# EAGLE design BGC main (EAGLE 7.0.0)
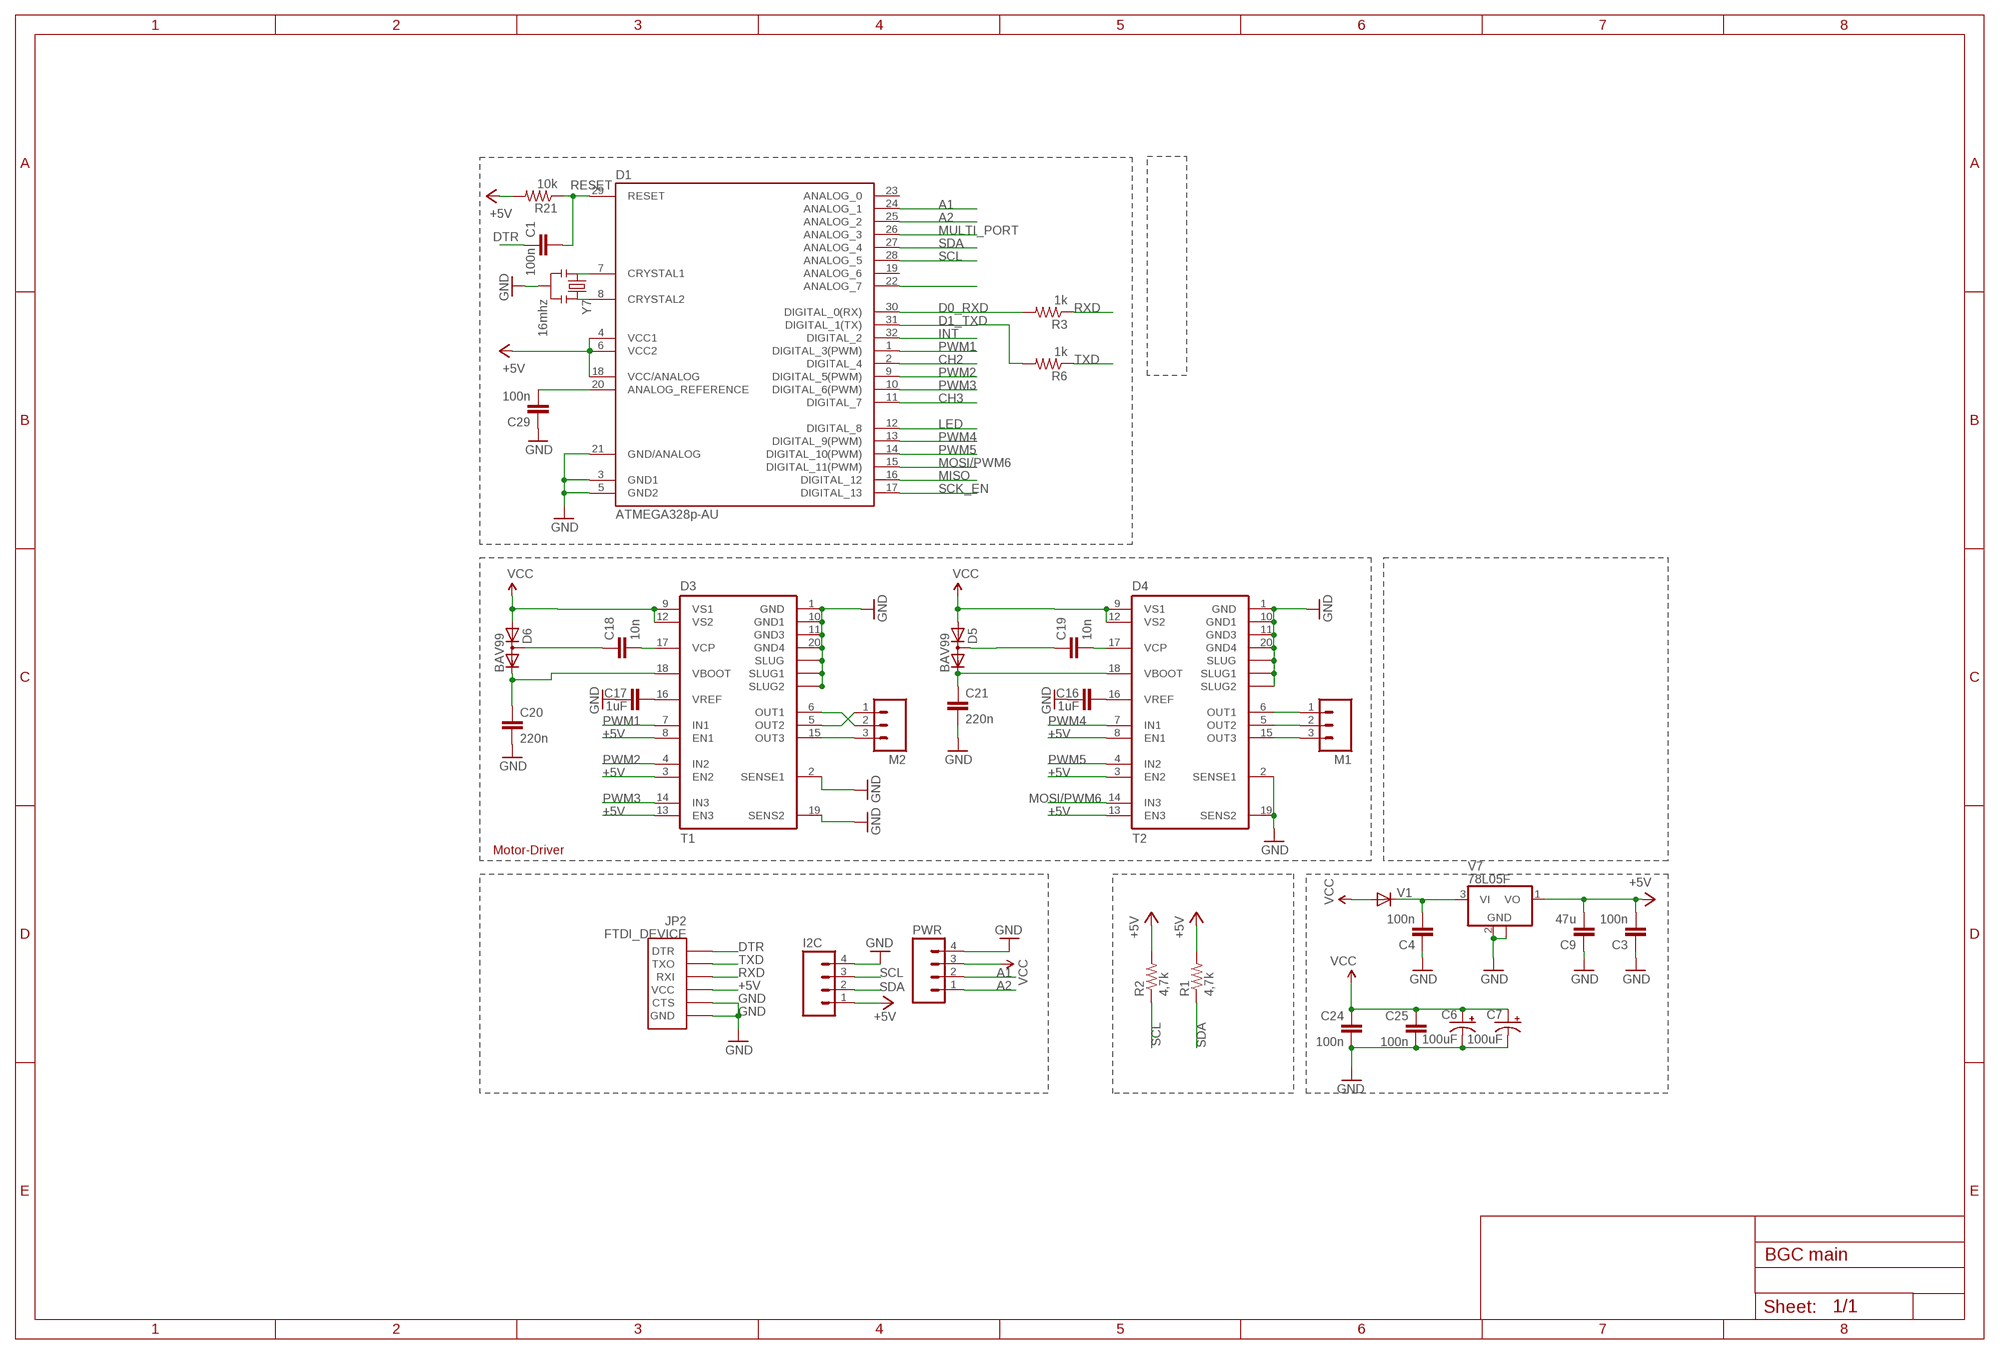
[diagram p0: schematic, sheet 1]

## Parts
C1  100n  CAP0402-CAP  [0402-CAP]
C3  100n  CAP0402-CAP  [0402-CAP]
C4  100n  CAP0402-CAP  [0402-CAP]
C6  100uF  100UF-10V-10%(TANT)  [EIA7343]
C7  100uF  100UF-10V-10%(TANT)  [EIA7343]
C9  47u  C-EUC1210  [C1210]
C16  1uF  CAP0402-CAP  [0402-CAP]
C17  1uF  CAP0402-CAP  [0402-CAP]
C18  10n  CAP0402-CAP  [0402-CAP]
C19  10n  CAP0402-CAP  [0402-CAP]
C20  220n  CAP0402-CAP  [0402-CAP]
C21  220n  CAP0402-CAP  [0402-CAP]
C24  100n  CAP0402-CAP  [0402-CAP]
C25  100n  CAP0402-CAP  [0402-CAP]
C29  100n  CAP0402-CAP  [0402-CAP]
D1  ATMEGA328p-AU  ATMEGA168-AU  [TQFP32-08]
D3  T1  L6234  [SO20POWER2]
D4  T2  L6234  [SO20POWER2]
D5  BAV99  BAV199  [SOT23]
D6  BAV99  BAV199  [SOT23]
I2C  M04PTH  [1X04]
JP2  FTDI_DEVICE  [FTDI_DEVICE_SIDE]
M1  M03PTH  [1X03]
M2  M03PTH  [1X03]
PWR  M04PTH  [1X04]
R1  4,7k  RESISTOR0402-RES  [0402-RES]
R2  4,7k  RESISTOR0402-RES  [0402-RES]
R3  1k  RESISTOR0402-RES  [0402-RES]
R6  1k  RESISTOR0402-RES  [0402-RES]
R21  10k  RESISTOR0402-RES  [0402-RES]
V1  DIODE-DO214AC  [DO214AC]
V7  78L05F  [SOT89]
Y7  16mhz  RESONATORSMD  [RESONATOR-SMD]

## Nets
+5V: C3.2 C9.2 D1.4(VCC1) D1.6(VCC2) D1.18(VCC/ANALOG) D3.3(EN2) D3.8(EN1) D3.13(EN3) D4.3(EN2) D4.8(EN1) D4.13(EN3) I2C.1 JP2.P$4(VCC) R1.2 R2.2 R21.2 V7.1(VO)
A1: D1.24(ANALOG_1) PWR.2
A2: D1.25(ANALOG_2) PWR.1
A7: D1.22(ANALOG_7)
CH2: D1.2(DIGITAL_4)
CH3: D1.11(DIGITAL_7)
D0_RXD: D1.30(DIGITAL_0(RX)) R3.2
D1_TXD: D1.31(DIGITAL_1(TX)) R6.2
DTR: C1.1 JP2.P$1(DTR)
GND: C3.1 C4.1 C6.C(-) C7.C(-) C9.1 C16.1 C17.1 C20.2 C21.2 C24.2 C25.2 C29.1 D1.3(GND1) D1.5(GND2) D1.21(GND/ANALOG) D3.1(GND) D3.2(SENSE1) D3.10(GND1) D3.11(GND3) D3.19(SENS2) D3.20(GND4) D3.SLUG1(SLUG2) D3.SLUG2(SLUG) D3.SLUG(SLUG1) D4.1(GND) D4.2(SENSE1) D4.10(GND1) D4.11(GND3) D4.19(SENS2) D4.20(GND4) D4.SLUG1(SLUG2) D4.SLUG2(SLUG) D4.SLUG(SLUG1) I2C.4 JP2.P$5(CTS) JP2.P$6(GND) PWR.4 V7.2(GND) V7.2@1(GND) Y7.2
INT: D1.32(DIGITAL_2)
LED: D1.12(DIGITAL_8)
MISO: D1.16(DIGITAL_12)
MOSI/PWM6: D1.15(DIGITAL_11(PWM)) D4.14(IN3)
MULTI_PORT: D1.26(ANALOG_3)
N$7: C16.2 D4.16(VREF)
N$8: C17.2 D3.16(VREF)
N$17: C18.2 D3.17(VCP)
N$18: C19.2 D4.17(VCP)
N$19: C19.1 D5.3(AC)
N$20: C21.1 D4.18(VBOOT) D5.2(C)
N$21: D3.15(OUT3) M2.3
N$23: D4.6(OUT1) M1.1
N$24: D4.5(OUT2) M1.2
N$25: D4.15(OUT3) M1.3
N$27: D3.5(OUT2) M2.1
N$28: D3.6(OUT1) M2.2
N$38: D1.8(CRYSTAL2) Y7.3
N$39: D1.7(CRYSTAL1) Y7.1
N$40: C29.2 D1.20(ANALOG_REFERENCE)
PWM1: D1.1(DIGITAL_3(PWM)) D3.7(IN1)
PWM2: D1.9(DIGITAL_5(PWM)) D3.4(IN2)
PWM3: D1.10(DIGITAL_6(PWM)) D3.14(IN3)
PWM4: D1.13(DIGITAL_9(PWM)) D4.7(IN1)
PWM5: D1.14(DIGITAL_10(PWM)) D4.4(IN2)
RESET: C1.2 D1.29(RESET) R21.1
RXD: JP2.P$3(RXI) R3.1
SCK_EN: D1.17(DIGITAL_13)
SCL: D1.28(ANALOG_5) I2C.3 R2.1
SDA: D1.27(ANALOG_4) I2C.2 R1.1
TXD: JP2.P$2(TXO) R6.1
VBOOT1: C20.1 D3.18(VBOOT) D6.2(C)
VCC: C6.A(+) C7.A(+) C24.1 C25.1 D3.9(VS1) D3.12(VS2) D4.9(VS1) D4.12(VS2) D5.1(A) D6.1(A) PWR.3 V1.A
VCC_VI: C4.2 V1.C V7.3(VI)
VCP1: C18.1 D6.3(AC)
Unconnected: D1.19(ANALOG_6) D1.23(ANALOG_0)

## Notes on the sheet
- FTDI
- Motor-Driver

## Library data of the parts
C1 C3 C4 C16-C21 C24 C25 C29 = SparkFun-Capacitors:CAP: Capacitor Standard 0603 ceramic capacitor, and 0.1" leaded capacitor.
C6 C7 = SparkFun-Capacitors:100UF-10V-10%(TANT): CAP-07890; PROD_ID: CAP-07890
C9 = rcl:C-EU: CAPACITOR, European symbol
D1 = Arduino-AVR:ATMEGA168
D3 D4 = L6234:L6234
D5 D6 = diode:BAV199: DIODE low-leakage double diode
I2C PWR = SparkFun-Connectors:M04: Header 4 Standard 4-pin 0.1" header. Use with straight break away headers (SKU : PRT-00116), right angle break away headers (PRT-00553), swiss pins (PRT-00743), machine pins (PRT-00117), and female headers (PRT-00115). Molex polarized connector foot print use with SKU : PRT-08231 with associated crimp pins and housings. 1MM SMD Version SKU: PRT-10208
JP2 = SparkFun-Connectors:FTDI_DEVICE: Connector which mates to FTDI basic or FTDI cable.
M1 M2 = SparkFun:M03: Header 3 Standard 3-pin 0.1" header. Use with straight break away headers (SKU : PRT-00116), right angle break away headers (PRT-00553), swiss pins (PRT-00743), machine pins (PRT-00117), and female headers (PRT-00115). Molex polarized connector foot print use with SKU : PRT-08232 with associated crimp pins and housings.
R1-R3 R6 R21 = SparkFun-Passives:RESISTOR: Resistor Basic schematic elements and footprints for 0603, 1206, and PTH resistors.
V1 = diode:DIODE-: DIODE
V7 = linear:78L*: POSITOIV-VOLTAGE REGULATORS Output up to 100 mA Source: http://focus.ti.com/lit/ds/symlink/ua78l05.pdf
Y7 = SparkFun:RESONATOR: Resonator Small SMD resonator. This is the itty bitty 10/20MHz resonators with built in caps. CSTCE10M0G55 and CSTCE20M0V53. Footprint has been reviewed closely but hasn't been tested yet.

## Net classes
0 default: width 0.152 mm, clearance 0.152 mm

## Board
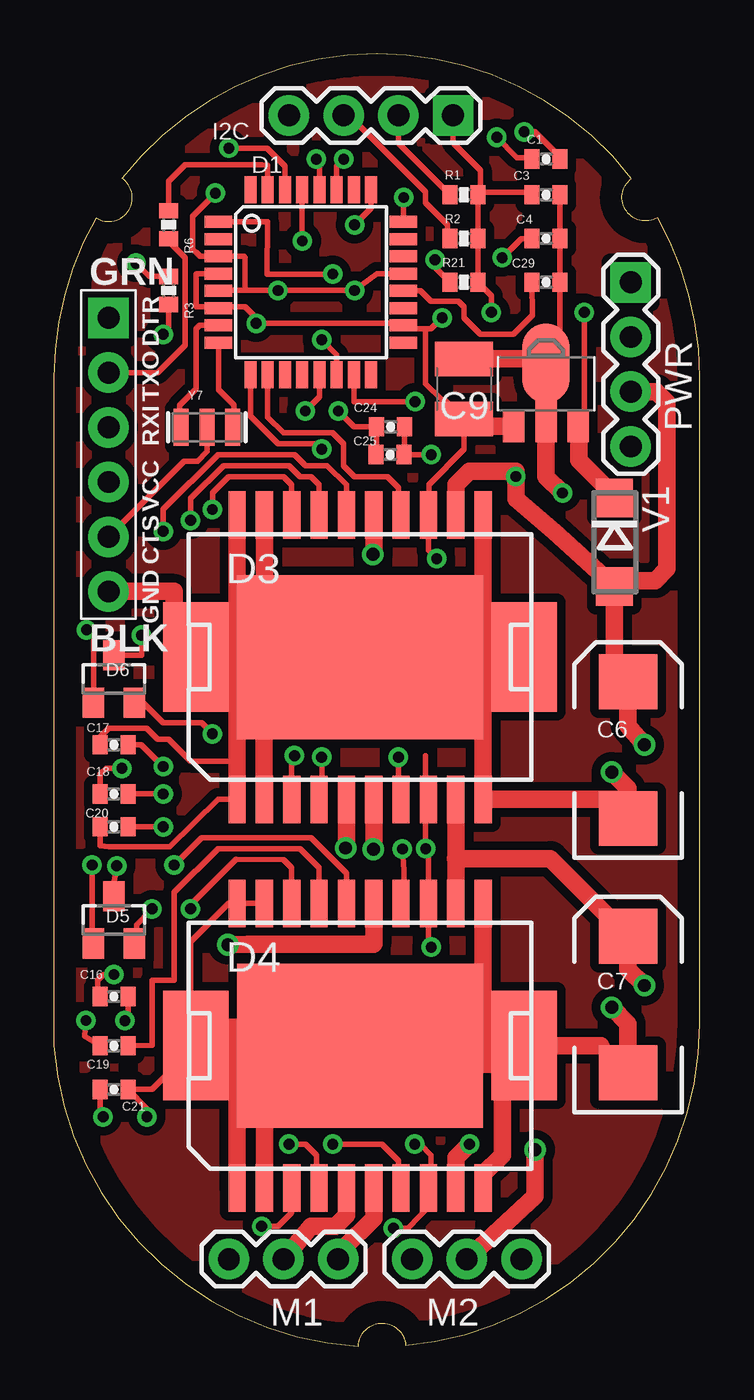
[diagram p1: board, top side]
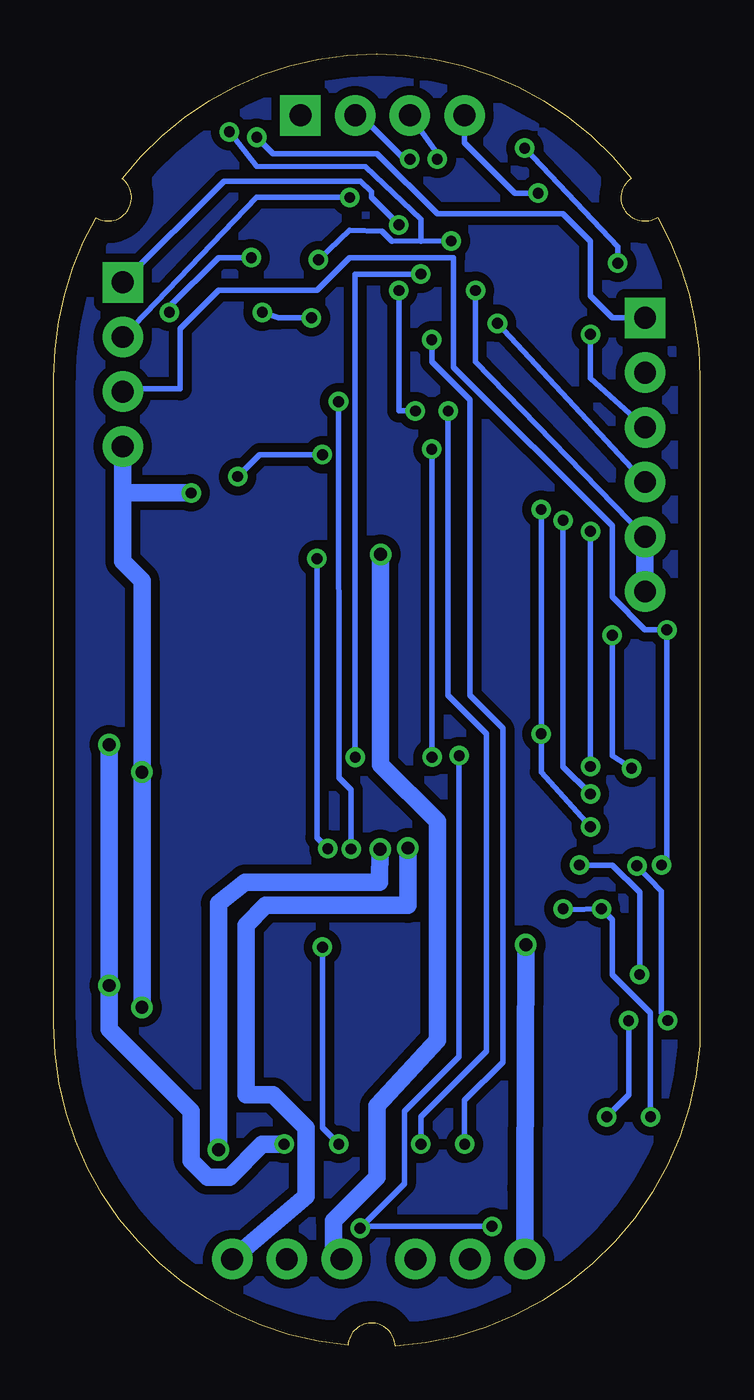
[diagram p2: board, bottom side, seen from below]

Size 30 x 59.98 mm. Coordinates in mm from the lower left corner, seen from the top.
Outline: 26.83,54.19 arc52 15.02,59.98 15,59.97 15,59.97 arc52 3.18,54.2
Outline: 3.18,54.2 arc-177 1.96,52.37 arc30 0,44.97 0,13.94 arc82 14.14,0 arc-175 16.34,0.03 arc85 30,14.95 30,14.97 30,44.97 arc30 28.04,52.37 arc-174 26.83,54.19
Copper layers (1*16): Top 0.035mm / dielectric 1.5mm / Bottom 0.035mm
Design rules "default *": minimum track width 6mil, minimum drill 12mil, track to track 6mil, track to pad 6mil, pad to pad 6mil, via to via 6mil, smd to smd 6mil, copper to edge 40mil, drill to drill 8mil, minimum pad ring 10mil, minimum via ring 8mil, stop-mask expansion 4mil, vias tented up to drill 0mil, thermal gap 10mil

### Footprints (pad centres in the part's own frame; a part is rotated, then mirrored left to right if it is on the bottom)
0402-CAP = smd 0.7 x 0.9: 1 -0.65,0; 2 0.65,0
EIA7343 = smd 2.55 x 2.7: A 3.17,0; C -3.17,0
C1210 = smd 1.6 x 2.7: 1 -1.4,0; 2 1.4,0
TQFP32-08 = smd 1.27 x 0.559: 1 -4.293,2.8; 2 -4.293,2; 3 -4.293,1.2; 4 -4.293,0.4; 5 -4.293,-0.4; 6 -4.293,-1.2; 7 -4.293,-2; 8 -4.293,-2.8; 17 4.293,-2.8; 18 4.293,-2; 19 4.293,-1.2; 20 4.293,-0.4; 21 4.293,0.4; 22 4.293,1.2; 23 4.293,2; 24 4.293,2.8 | smd 0.559 x 1.27: 9 -2.8,-4.293; 10 -2,-4.293; 11 -1.2,-4.293; 12 -0.4,-4.293; 13 0.4,-4.293; 14 1.2,-4.293; 15 2,-4.293; 16 2.8,-4.293; 25 2.8,4.293; 26 2,4.293; 27 1.2,4.293; 28 0.4,4.293; 29 -0.4,4.293; 30 -1.2,4.293; 31 -2,4.293; 32 -2.8,4.293
SO20POWER2 = smd 0.8 x 2.2: 1 -5.715,-6.6; 2 -4.445,-6.6; 3 -3.175,-6.6; 4 -1.905,-6.6; 5 -0.635,-6.6; 6 0.635,-6.6; 7 1.905,-6.6; 8 3.175,-6.6; 9 4.445,-6.6; 10 5.715,-6.6; 11 5.715,6.6; 12 4.445,6.6; 13 3.175,6.6; 14 1.905,6.6; 15 0.635,6.6; 16 -0.635,6.6; 17 -1.905,6.6; 18 -3.175,6.6; 19 -4.445,6.6; 20 -5.715,6.6 | smd 3.048 x 5.08: SLUG -7.62,0; SLUG2 7.62,0 | smd 11.43 x 7.62: SLUG1 0,0
SOT23 = smd 1 x 1.4: 1 -0.95,-1.1; 2 0.95,-1.1; 3 0,1.1
1X04 = drill 1.016 pad 1.88 square: 1 0,0 | drill 1.016 pad 1.88: 2 2.54,0; 3 5.08,0; 4 7.62,0
FTDI_DEVICE_SIDE = drill 1.016 pad 1.88 square: P$1 -6.35,0 | drill 1.016 pad 1.88: P$2 -3.81,0; P$3 -1.27,0; P$4 1.27,0; P$5 3.81,0; P$6 6.35,0
1X03 = drill 1.016 pad 1.88: 1 0,0; 2 2.54,0; 3 5.08,0
0402-RES = smd 0.7 x 0.9: 1 -0.65,0; 2 0.65,0
DO214AC = smd 1.8 x 1.7: A 2.05,0; C -2.05,0
SOT89 = smd 1 x 1.5: 1 -1.499,-1.981; 3 1.499,-1.981 | smd 1 x 2: 2 0,-1.727 | smd 2.2 x 3.7: 2@1 0,0.94
RESONATOR-SMD = smd 0.7 x 1.7: 1 -1.2,0; 2 0,0; 3 1.2,0

### Placement (x,y rotation side)
C1  22.86,55.09 0 top
C3  22.86,53.44 180 top
C4  22.86,51.41 180 top
C6  26.67,27.66 90 top
C7  26.67,15.85 90 top
C9  19.05,44.42 270 top
C16  2.79,16.23 180 top
C17  2.79,27.91 0 top
C18  2.79,25.63 0 top
C19  2.79,13.94 0 top
C20  2.79,24.1 180 top
C21  2.79,11.91 0 top
C24  15.64,42.67 180 top
C25  15.62,41.38 180 top
C29  22.86,49.38 180 top
D1  11.94,49.38 0 top
D3  14.22,31.98 0 top
D4  14.22,13.94 0 top
D5  2.79,19.79 0 top
D6  2.79,30.96 0 top
I2C  18.54,57.12 180 top
JP2  2.54,41.38 270 top
M1  13.21,4.04 180 top
M2  21.72,4.04 180 top
PWR  26.8,49.38 270 top
R1  19.05,53.44 0 top
R2  19.05,51.41 0 top
R3  5.33,49 90 top
R6  5.33,52.04 90 top
R21  19.05,49.38 0 top
V1  26.04,37.31 270 top
V7  22.86,44.68 0 top
Y7  7.11,42.65 0 top

### Tracks (layer width: path | path; a pad name or v marks a point on that pad's centre or on a via)
+5V  (via drill 0.5)
  Top 0.254: I2C.1 18.54,55.85 19.81,54.58 19.81,53.55 | 19.81,53.55 R1.2 R2.2 R21.2 20.32,48.76 v20.32,47.98 | 19.81,53.55 22.1,53.55 C3.2 | D1.4 6.62,49.78 6.6,49.76 6.6,48.23 7.59,48.23 D1.6 7.7,48.23 8.89,48.23 9.4,47.73 v9.4,47.47 16.14,47.47 D1.18 16.39,47.22 17.27,47.22 | D4.3 11.05,6.2 10.41,5.56 v9.65,5.56 | v15.77,5.47 16.45,5.47 17.53,6.58 17.53,7.22 D4.8 17.53,7.47 17.53,8.86 17.02,9.37 v16.76,9.37 | 17.27,47.22 17.27,44.68 18.03,43.92 18.16,43.92 C9.2 19.05,41.88 19.05,41.63 17.42,39.98 D3.13 17.4,36.93 v17.78,36.55 | 17.27,25.25 v17.27,23.09 17.4,22.96 D4.13 17.4,18.64 v17.53,18.52 | 17.27,25.25 D3.8 | 17.27,27.41 17.27,25.25 | D3.3 11.05,27.28 v11.18,27.41 | 17.27,47.22 17.53,47.22 v18.03,47.73
  Top 0.813: V7.1 19.38,42.7 C9.2
  Bottom 0.254: JP2.P$4 v9.4,47.47 | v9.65,5.56 15.49,5.56 v15.77,5.47 13.72,7.53 13.72,10.9 11.18,13.44 v11.18,27.41 | v18.03,47.73 19.56,47.73 v20.32,47.98 | v17.78,36.55 17.78,23.6 v17.27,23.09 | v17.53,18.52 17.53,10.13 v16.76,9.37
A1  (via drill 0.5)
  Top 0.254: D1.24 16.23,53.29 v16.26,53.31
  Bottom 0.254: v16.26,53.31 20.57,53.31 PWR.2
A2  (via drill 0.5)
  Top 0.254: D1.25 14.74,52.81 v13.97,52.04
  Bottom 0.254: v13.97,52.04 15.24,53.31 15.24,53.57 15.75,54.08 22.1,54.08 PWR.1
D0_RXD  (via drill 0.5)
  Top 0.254: D1.30 10.74,54.77 9.91,55.6 v8.13,55.6 | R3.2 4.43,49.65 v3.81,50.27
  Bottom 0.254: v3.81,50.27 3.81,51.03 v8.13,55.6
D1_TXD
  Top 0.254: D1.31 9.94,54.81 9.65,54.84 6.1,54.84 5.33,54.08 R6.2
DTR  (via drill 0.5)
  Top 0.254: v20.57,56.11 21.52,55.16 22.14,55.16 C1.1
  Bottom 0.254: v20.57,56.11 19.81,55.35 14.99,55.35 12.19,52.55 6.35,52.55 5.08,51.28 5.08,48.74 4.06,47.73 JP2.P$1
GND  (via drill 0.5, 0.6)
  Top 0.254: C3.1 C4.1 C29.1 23.51,46.27 V7.2@1 | 8.89,49 8.89,50.52 8.83,50.58 D1.3 6.8,50.58 6.6,50.77 6.44,50.89 6.44,52.45 v7.5,53.51 | 8.89,49 7.66,49 D1.5 | 8.89,49 v10.41,49 v13.97,49 15.01,49.78 D1.21 | v13.21,43.41 13.95,42.67 C24.2 14.99,41.4 C25.2 | 26.41,25.38 26.67,25.12 | 19.94,32.36 20.32,31.98 | 25.41,13.94 C7.C | 19.94,13.82 20.07,13.94 | Y7.2 7.11,41.52 6.67,41.08 6.05,41.08 JP2.P$5 | 8.51,32.36 8.13,31.98 | C20.2 2.14,23.23 2.57,23.19 5.38,23.19 7.62,25.37 D3.1 | 8.51,31.85 8.64,31.98 | D3.2 | C17.1 2.14,28.28 2.54,28.68 4.32,28.68 4.83,28.17 5.33,28.17 6.35,27.15 8.51,27.15 | 9.78,31.86 9.65,31.98 | 9.78,32.11 9.91,31.98 | 5.59,32.99 D3.SLUG | 8.51,13.82 8.64,13.94 | 9.78,13.56 9.4,13.94 | C16.1 3.44,15.36 v3.3,15.11 | v4.32,10.64 4.32,11.04 C21.2 4.57,11.91 D4.SLUG 6.35,14.2 6.35,18.77 8.12,20.54 D4.20 D4.19 | 19.94,14.07 19.81,13.94
  Top 0.813: C6.C 26.67,25.12 26.67,25.88 v25.91,26.64 | v25.91,15.72 26.67,14.97 C7.C | C9.1 22.65,45.82 V7.2@1 V7.2 22.86,40.36 v23.62,39.6 | 26.41,25.38 D3.10 19.94,32.36 D3.11 | D4.SLUG2 25.41,13.94 | D4.10 19.94,7.98 20.83,8.86 20.83,13.44 21.34,13.94 | D3.20 8.51,32.36 | D3.1 8.51,27.15 8.51,31.85 | D3.2 9.78,31.86 | D3.19 9.78,32.11 | JP2.P$6 5.59,35.03 5.59,32.99 | D4.1 8.51,13.82 | D4.2 9.78,13.56 | D4.11 19.94,14.07
  Top 2.54: D3.SLUG 8.13,31.98 8.64,31.98 9.65,31.98 9.91,31.98 D3.SLUG1 20.32,31.98 D3.SLUG2 | D4.SLUG 8.64,13.94 9.4,13.94 D4.SLUG1 19.81,13.94 20.07,13.94 21.34,13.94 D4.SLUG2
  Bottom 0.254: JP2.P$5 10.41,45.69 v10.41,49 | v13.21,43.41 13.97,43.41 v13.97,49 | v3.3,15.11 3.3,11.66 v4.32,10.64 | v7.5,53.51 8.58,53.51 10.92,55.85 I2C.4
  Bottom 0.813: v25.91,15.72 v25.91,26.64 25.91,35.53 26.8,36.42 26.8,39.85 | PWR.4 26.8,39.85 | v23.62,39.6 26.54,39.6 26.8,39.85 | JP2.P$5 JP2.P$6
MOSI/PWM6  (via drill 0.5)
  Top 0.254: D1.15 13.94,43.95 13.94,43.84 v16.78,43.84 | v16.19,23.08 16.26,22.07 16.26,20.67 D4.14
  Bottom 0.254: v16.78,43.84 16.76,26.39 16.19,25.82 v16.19,23.08
N$4
  pour Top (isolate 0.406): 15.24,59.92 15.49,59.92 arc-90 29.97,45.44 29.97,14.71 arc-90 15.24,-0.03 14.48,-0.03 arc-90 0,14.45 0,44.68 arc-90
N$5
  pour Bottom (isolate 0.406): 15.24,59.92 15.49,59.92 arc-90 29.97,45.44 29.97,14.71 arc-90 15.24,-0.03 14.99,-0.03 arc-90 0,14.96 0,44.68 arc-90
N$7  (via drill 0.5)
  Top 0.254: D4.16 13.59,21.95 11.94,23.6 6.86,23.6 v5.59,22.33 | v2.79,17.25 2.29,17.25 2.03,16.99 2.03,16.34 C16.2
  Bottom 0.254: v5.59,22.33 4.06,22.33 2.79,21.06 v2.79,17.25
N$8  (via drill 0.5)
  Top 0.254: D3.16 13.59,39.98 12.7,40.87 11.68,40.87 11.18,41.38 7.62,41.38 5.08,38.84 v5.08,37.82 | v5.08,26.9 4.06,27.91 C17.2
  Bottom 0.254: v5.08,37.82 v5.08,26.9
N$17  (via drill 0.5)
  Top 0.254: D3.17 12.32,39.98 11.94,40.36 11.43,40.36 10.92,40.87 7.87,40.87 6.35,39.34 v6.35,38.33 | v5.08,25.63 C18.2
  Bottom 0.254: v6.35,38.33 6.35,26.9 v5.08,25.63
N$18
  Top 0.254: D4.17 12.32,22.2 11.43,23.09 7.62,23.09 5.59,21.06 5.59,16.99 4.57,16.99 4.57,13.98 C19.2
N$19  (via drill 0.5)
  Top 0.254: D5.3 2.79,21.56 v2.92,22.29 | v1.49,15.11 1.43,14.37 C19.1
  Bottom 0.254: v2.92,22.29 1.78,21.12 1.78,15.47 v1.49,15.11
N$20  (via drill 0.5)
  Top 0.254: D4.18 11.05,22.2 10.67,22.58 8.47,22.61 6.35,20.49 v6.35,20.29 | v4.56,20.3 3.84,19.57 3.81,18.75 D5.2 | C21.1 2.14,10.78 v2.29,10.64
  Bottom 0.254: v6.35,20.29 6.07,20.26 v4.56,20.3 4.06,19.8 4.06,17.25 2.29,15.47 v2.29,10.64
N$21  (via drill 0.6)
  Top 0.813: D3.15 14.86,36.9 v14.82,36.75
  Bottom 0.813: v14.82,36.75 14.82,26.98 12.19,24.36 12.19,14.2 14.99,11.15 14.99,7.85 17.02,5.82 17.02,4.42 M2.3
N$23
  Top 0.813: D4.6 14.86,5.94 13.46,4.55 13.46,4.29 M1.1
N$24
  Top 0.813: D4.5 13.59,6.07 13.08,5.57 11.94,5.57 M1.2
N$25  (via drill 0.6)
  Top 0.813: D4.15 14.86,18.67 14.84,18.65 9.02,18.65 v8.08,18.63
  Bottom 0.813: v8.08,18.63 8.13,7.34 M1.3
N$27  (via drill 0.6)
  Top 0.813: D3.5 13.59,23.15 v13.56,23.12
  Bottom 0.813: v13.56,23.12 13.56,20.45 20.16,20.45 21.08,19.53 21.08,11.66 19.81,11.66 18.29,10.13 18.29,6.96 M2.1
N$28  (via drill 0.6)
  Top 0.813: D3.6 14.86,23.72 v14.84,23.06 | v22.35,9.12 22.35,6.96 M2.2
  Bottom 0.813: v14.84,23.06 14.87,21.54 21.11,21.54 22.35,20.55 v22.35,9.12
N$38
  Top 0.254: D1.8 7.64,44.4 8.38,43.66 8.38,42.21 Y7.3
N$39
  Top 0.254: D1.7 6.76,47.38 6.6,47.22 6.6,44.42 5.84,43.66 5.84,42.21 Y7.1
N$40
  Top 0.254: D1.20 17.04,48.98 17.53,48.49 18.8,48.49 19.05,48.23 19.05,47.73 19.81,46.96 21.34,46.96 22.23,47.84 C29.2
PWM1  (via drill 0.5)
  Top 0.254: D1.1 9.92,52.18 9.91,49.76 v12.95,49.76 | v16,27.33 16,25.51 D3.7
  Bottom 0.254: v12.95,49.76 16,49.76 v16,27.33
PWM2  (via drill 0.5)
  Top 0.254: D1.9 9.14,43.16 10.41,41.88 12.19,41.88 v12.45,41.63 | v12.44,27.34 12.45,26.9 12.45,25.51 D3.4
  Bottom 0.254: v12.45,41.63 12.45,27.91 v12.44,27.34
PWM3
  Top 0.254: D1.10 9.94,43.12 10.67,42.39 12.95,42.39 13.46,41.88 13.46,40.87 13.97,40.36 15.49,40.36 16,39.85 16,38.71 D3.14
PWM4  (via drill 0.5)
  Top 0.254: D1.13 12.34,44.06 v11.68,43.41 | D4.7 16,7.47 16,8.61 15.24,9.37 v12.95,9.37
  Bottom 0.254: v11.68,43.41 11.68,30.2 9.91,28.42 9.91,13.69 12.95,10.64 v12.95,9.37
PWM5  (via drill 0.5)
  Top 0.254: D1.14 13.14,46.02 v12.45,46.71 | v10.92,9.37 11.68,9.37 12.19,8.86 12.19,7.47 D4.4
  Bottom 0.254: v12.45,46.71 12.45,45.69 10.67,43.92 10.67,30.2 9.14,28.68 9.14,13.18 10.92,11.4 v10.92,9.37
RESET  (via drill 0.5)
  Top 0.254: D1.29 11.54,52.19 v11.54,51.3 | C1.2 23.51,55.2 22.35,56.36 v21.84,56.36 | v17.71,50.42 17.71,50.07 R21.1
  Bottom 0.254: v17.71,50.42 16.26,51.79 14.76,51.75 14.3,51.28 v11.54,51.3 12.95,51.28 12.95,52.3 15.54,54.74 20.57,54.77 v21.84,56.36
RXD  (via drill 0.5)
  Top 0.254: R3.1 5.33,47.22 v5.08,46.96
  Bottom 0.254: v5.08,46.96 5.08,44.93 JP2.P$3
SCL  (via drill 0.5)
  Top 0.254: I2C.3 13.97,56.87 17.27,53.57 17.27,53.06 18.29,52.04 18.29,51.52 R2.1 | D1.28 12.34,54.95 v12.19,55.09
  Bottom 0.254: v12.19,55.09 12.19,55.35 I2C.3
SDA  (via drill 0.5)
  Top 0.254: I2C.2 16,55.84 R1.1 | D1.27 13.14,54.77 v13.46,55.09
  Bottom 0.254: v13.46,55.09 13.72,55.09 15.75,57.12 I2C.2
TXD
  Top 0.254: R6.1 5.33,51.28 6.1,50.52 6.1,46.46 4.83,45.19 JP2.P$2
VBOOT1  (via drill 0.5)
  Top 0.254: D3.18 11.05,39.98 10.67,40.36 8.13,40.36 7.37,39.6 v7.37,38.84 | v5.08,24.1 C20.1 | D6.2 4.15,29.86 5.08,28.93 6.86,28.93 v7.37,28.42
  Bottom 0.254: v7.37,38.84 v7.37,28.42 7.37,26.64 v5.08,24.1
VCC  (via drill 0.5, 0.6)
  Top 0.254: 26.04,31.47 C6.A | 26.66,35.4 26.04,34.77 | v17.53,41.38 C25.1 16.29,41.4 C24.1 | v21.46,40.36 21.46,40.11 21.46,40.1 | 1.84,32.81 D6.1 1.84,32.93 v1.52,33.25 | v1.78,22.33 1.78,18.75 D5.1
  Top 0.813: v27.43,16.74 26.67,17.5 C7.A 23.06,22.63 18.65,22.63 | v27.43,27.91 26.67,28.8 C6.A | D3.12 18.67,39.98 19.3,40.61 21.46,40.61 v21.46,40.36 21.46,40.1 21.46,39.34 23.24,37.8 V1.A 26.04,34.77 26.04,31.47 | D4.12 18.67,22.61 18.65,22.63 | D3.9 18.67,22.64 18.65,22.63 | PWR.3 27.98,44.3 28.48,43.8 28.48,36.07 27.94,35.53 26.8,35.53 26.66,35.4 | D4.9 18.67,8.74 v19.3,9.37
  Bottom 0.254: v17.53,41.38 20.44,41.38 v21.46,40.36 | PWR.3 26.67,44.42 24.13,44.42 24.13,47.22 22.35,49 17.78,49 16.26,50.52 11.43,50.52 11.43,45.44 4.06,38.07 4.06,34.77 2.54,33.25 v1.52,33.25 1.52,22.58 v1.78,22.33
  Bottom 0.813: v27.43,27.91 v27.43,16.74 27.43,14.71 23.62,10.9 23.62,8.61 22.86,7.85 21.84,7.85 20.32,9.37 v19.3,9.37
VCC_VI  (via drill 0.5)
  Top 0.254: C4.2 21.72,51.41 v20.83,50.52 | v24.64,47.98 24.64,42.98 V7.3
  Top 0.813: V1.C 26.04,39.47 24.38,41.12 24.38,42.67 V7.3
  Bottom 0.254: v20.83,50.52 22.35,50.52 24.64,48.23 v24.64,47.98
VCP1  (via drill 0.5)
  Top 0.254: D6.3 4.09,32.06 v4.06,32.99 | v3.17,26.82 2.43,26.82 2.16,26.57 C18.1
  Bottom 0.254: v4.06,32.99 4.06,27.41 v3.17,26.82